# Altium schematic sheet 12V_Buck_Converter.SchDoc
size A3; SheetNumber: 1; SheetTotal: 2
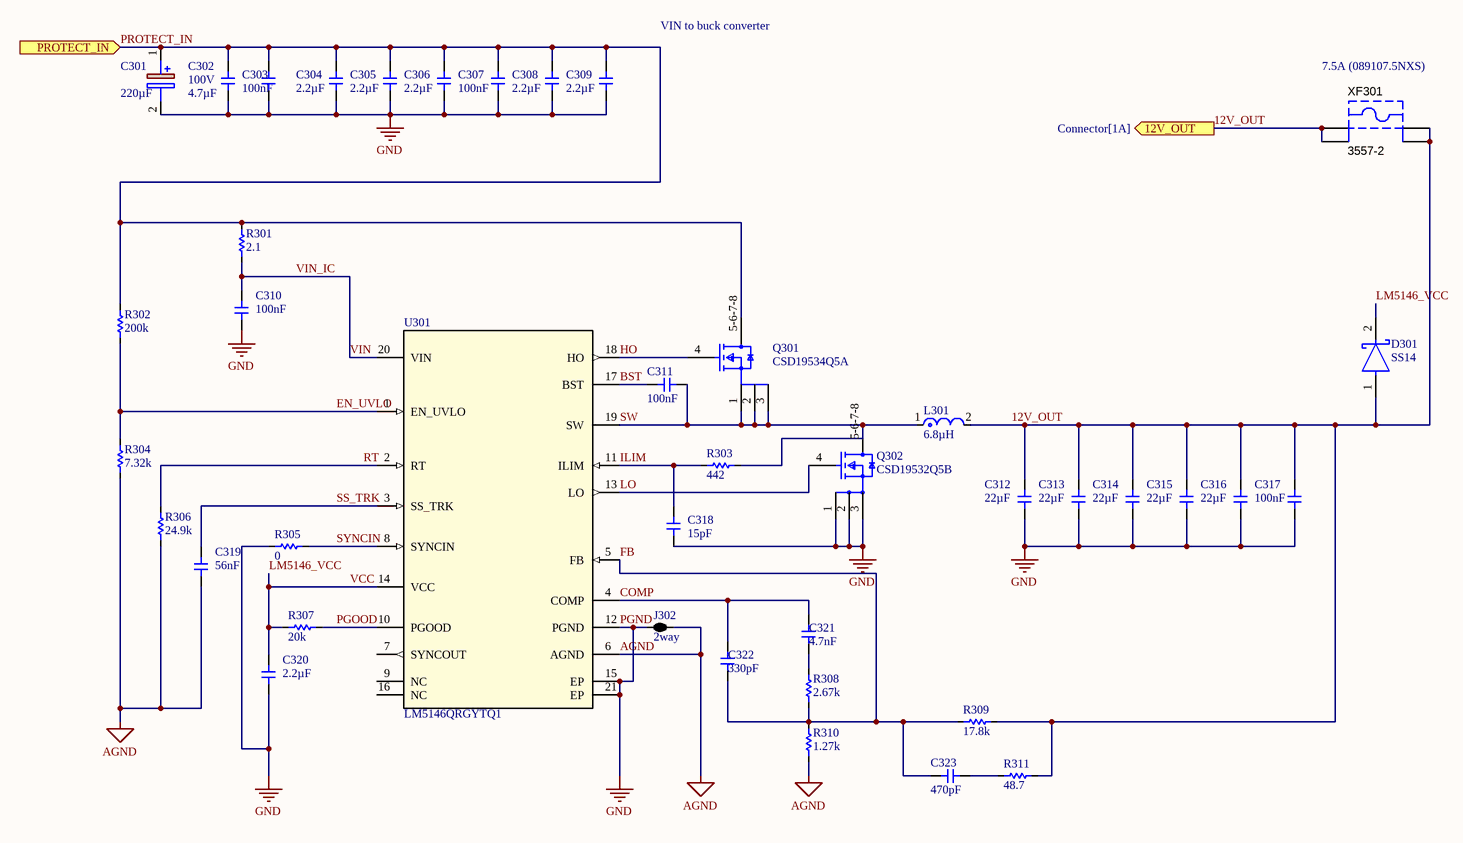
[diagram p0: 12V_Buck_Converter.SchDoc]

## Parts
C301  220µF  [EEEFK0J103SM]
C302  Voltage: 100V  Capacitance: 4.7µF  [1210]  (hidden comment: non-polar_Capacitor)
C303  Capacitance: 100nF  [0603]  (hidden comment: non-polar_Capacitor)
C304  Capacitance: 2.2µF  [1210]  (hidden comment: non-polar_Capacitor)
C305  Capacitance: 2.2µF  [1210]  (hidden comment: non-polar_Capacitor)
C306  Capacitance: 2.2µF  [0603]  (hidden comment: non-polar_Capacitor)
C307  Capacitance: 100nF  [0603]  (hidden comment: non-polar_Capacitor)
C308  Capacitance: 2.2µF  [1210]  (hidden comment: non-polar_Capacitor)
C309  Capacitance: 2.2µF  [1210]  (hidden comment: non-polar_Capacitor)
C310  Capacitance: 100nF  [0603]  (hidden comment: non-polar_Capacitor)
C311  Capacitance: 100nF  [0603]  (hidden comment: non-polar_Capacitor)
C312  Capacitance: 22µF  [1210]  (hidden comment: non-polar_Capacitor)
C313  Capacitance: 22µF  [1210]  (hidden comment: non-polar_Capacitor)
C314  Capacitance: 22µF  [1210]  (hidden comment: non-polar_Capacitor)
C315  Capacitance: 22µF  [1210]  (hidden comment: non-polar_Capacitor)
C316  Capacitance: 22µF  [1210]  (hidden comment: non-polar_Capacitor)
C317  Capacitance: 100nF  [0603]  (hidden comment: non-polar_Capacitor)
C318  Capacitance: 15pF  [0603]  (hidden comment: non-polar_Capacitor)
C319  Capacitance: 56nF  [0603]  (hidden comment: non-polar_Capacitor)
C320  Capacitance: 2.2µF  [1206]  (hidden comment: non-polar_Capacitor)
C321  Capacitance: 4.7nF  [0603]  (hidden comment: non-polar_Capacitor)
C322  Capacitance: 330pF  [0603]  (hidden comment: non-polar_Capacitor)
C323  Capacitance: 470pF  [0603]  (hidden comment: non-polar_Capacitor)
D301  SS14  [FP-403AE-MFG]
J302  2way  [2way_LP]  (net tie, no BOM)
L301  Inductance: 6.8µH  [FP-XAL1010-MFG]  (hidden comment: XAL1010)
Q301  CSD19534Q5A  [FP-DQJ0008A-MFG]
Q302  CSD19532Q5B  [FP-DNK0008A-MFG]
R301  Resistance: 2.1  [0603]  (hidden comment: Resistor)
R302  Resistance: 200k  [0603]  (hidden comment: Resistor)
R303  Resistance: 442  [0805]  (hidden comment: Resistor)
R304  Resistance: 7.32k  [0603]  (hidden comment: Resistor)
R305  Resistance: 0  [0603]  (hidden comment: Resistor)
R306  Resistance: 24.9k  [0603]  (hidden comment: Resistor)
R307  Resistance: 20k  [0603]  (hidden comment: Resistor)
R308  Resistance: 2.67k  [0603]  (hidden comment: Resistor)
R309  Resistance: 17.8k  [0603]  (hidden comment: Resistor)
R310  Resistance: 1.27k  [0603]  (hidden comment: Resistor)
R311  Resistance: 48.7  [0603]  (hidden comment: Resistor)
U301  LM5146QRGYTQ1  [RGY0020B]
XF301  3557-2  [KSTN-3557-2]

## Ports
12V_OUT (out, see Connector[1A]), PROTECT_IN (in)

## Nets
AGND: C319.1 J302.2 R304.1 R306.1 R310.2 U301.6(AGND)
PGND: C301.2(-) C302.1 C303.1 C304.1 C305.1 C306.1 C307.1 C308.1 C309.1 C310.1 C312.1 C313.1 C314.1 C315.1 C316.1 C317.1 C318.2 C320.1 J302.1 Q302.1(S) Q302.2(S) Q302.3(S) R305.1 U301.12(PGND) U301.15(EP) U301.21(EP)  [also labelled GND]
12V_OUT: C312.2 C313.2 C314.2 C315.2 C316.2 C317.2 D301.1(A) L301.2 R309.1 R311.1 XF301.1 XF301.2 XF301.3 XF301.4 ; port 12V_OUT
BST: C311.2 U301.17(BST)
COMP: C321.2 C322.2 U301.4(COMP)
EN_UVLO: R302.1 R304.2 U301.1(EN_UVLO)
FB: C322.1 C323.2 R308.1 R309.2 R310.1 U301.5(FB)
HO: Q301.4(G) U301.18(HO)
ILIM: C318.1 R303.1 U301.11(ILIM)
LM5146_VCC: C320.2 D301.2(C) R307.2 U301.14(VCC)  [also labelled VCC]
LO: Q302.4(G) U301.13(LO)
PGOOD: R307.1 U301.10(PGOOD)
PROTECT_IN: C301.1(+) C302.2 C303.2 C304.2 C305.2 C306.2 C307.2 C308.2 C309.2 Q301.5-6-7-8(D) R301.2 R302.2 ; port PROTECT_IN
RT: R306.2 U301.2(RT)
SS_TRK: C319.2 U301.3(SS_TRK)
SW: C311.1 L301.1 Q301.1(S) Q301.2(S) Q301.3(S) Q302.5-6-7-8(D) R303.2 U301.19(SW)
SYNCIN: R305.2 U301.8(SYNCIN)
VIN: C310.2 R301.1 U301.20(VIN)  [also labelled VIN_IC]
NetC321_1: C321.1 R308.2
NetC323_1: C323.1 R311.2

Not connected (* = marked no-connect by the designer): U301 7(SYNCOUT) 9(NC) 16(NC)

## Notes on the sheet
- VIN to buck converter
- 7.5A (089107.5NXS)

## Library data of the parts
C301 = EEV-FK2A221M: Capacitor Polarised; Manufacturer_Name: Panasonic; Datasheet Link: http://industrial.panasonic.com/cdbs/www-data/pdf/RDE0000/ABA0000C1181.pdf; Height: 17mm; Manufacturer_Part_Number: EEV-FK2A221M; Mouser Part Number: 667-EEV-FK2A221M; Mouser Price/Stock: https://www.mouser.co.uk/ProductDetail/Panasonic/EEV-FK2A221M?qs=f%252BPvLx1Hi0lum2kXFW5X7Q%3D%3D; Arrow Part Number: EEV-FK2A221M; Arrow Price/Stock: https://www.arrow.com/en/products/eevfk2a221m/panasonic?utm_currency=USD&region=nac
C302 = CMP-024-000020-16: SMD type ceramic capacitor; Source: robit_passive.SchLib; Design Item ID: Capacitor
C303 C317 = CMP-024-000020-16: SMD type ceramic capacitor; Voltage: 100V; Source: robit_passive.SchLib; Design Item ID: Capacitor
C304-C316 C318-C323 = CMP-024-000020-16: SMD type ceramic capacitor; Voltage: 50V; Source: robit_passive.SchLib; Design Item ID: Capacitor
D301 = CMP-2000-04943-2: DIODE SCHOTTKY 40V 1A SMA; Manufacturer: ON Semiconductor; Peak Reverse Current: 0.2mA; Max Junction Temp: +125°C; Standoff Height: 0.05mm; Max Surge Forward Current: 40A; Mouser Description: Schottky Diodes & Rectifiers SMA 40V 1.0A; RoHS: TRUE; Lead Free: Yes; Manufacturer Part Number: SS14; Device Class L3: Schottky Diodes; Category: Diode; Automotive: No; Digikey Description: DIODE SCHOTTKY 40V 1A SMA; ComponentLink2Description: Datasheet; Device Class L2: Diodes; Height: 2.5mm; Temperature Range High: +125°C; ComponentLink2URL: https://www.onsemi.com/pub/Collateral/SS19-D.PDF; Device Class L1: Discrete Semiconductors; Package: 403AE; Octopart: https://octopart.com/ss14-on+semiconductor-29205033; Max Repetitive Reverse Voltage: 40V; Temperature Range Low: -65°C; Forward Current: 1A; Temperature: -65°C to +125°C
J302 = CMP-187-000000-1: 2 way net tie junction; Source: NetTie.SchLib; ComponentLink1Description: Source; Design Item ID: 2way; Component Type: Net Tie; ComponentLink1URL: http://www.edatools.cz/addons; Pin Count: 2; FootprintNote: LP=12mil, MP=40mil, HP=120mil
L301 = CMP-028-000007-1: General Purpose Inductor, 5.6uH, 20%, 1 Element, Composite-Core, SMD, 4539
Q301 = CMP-04962-000018-1: MOSFET N-CH 100V 50 8SON; Manufacturer: Texas Instruments; Reverse Recovery Time: 53ns; Turn Off Delay Time: 20ns; Gate To Source Voltage: 20V; Turn On Delay Time: 9ns; Depletion Mode: False; Threshold Vgs Max: 3.4V; Pulse Drain Current: 137A; Number Of N Channels: 1; Input Capacitace At Vds: 1290pF @ 50V; Max Junction Temp: +150°C; Power Dissipation: 3.2W; Max Forward Diode Voltage: 1V; Continuous Drain Current: 10A; Drain To Source Resistance: 12.6mΩ; Threshold Vgs Min: 2.4V; Transconductance: 47S; Gate Charge At Vgs: 17nC @ 10V; Reverse Recovery Charge: 134nC; Typ Forward Diode Voltage: 0.8V; Rthja Max: 50°C/W; Drain To Source Breakdown Voltage: 100V; Device Class L2: Transistors; Height: 1.1mm; Temperature Range Low: -55°C; Temperature Range High: +150°C; Temperature: -55°C to +150°C; Device Class L1: Discrete Semiconductors; ComponentLink2Description: Datasheet; Number Of Channels: 1; Lead Free: Yes; Octopart: https://octopart.com/csd19534q5a-texas+instruments-46749514; Package: DQJ0008A; Category: Trans; Mouser Description: MOSFET N-Channel MOSFET; Device Class L3: MOSFETs; Digikey Description: MOSFET N-CH 100V 50 8SON; Drain To Source Voltage: 100V; Automotive: No; ComponentLink2URL: http://www.ti.com/lit/ds/symlink/csd19534q5a.pdf; RoHS: TRUE; Manufacturer Part Number: CSD19534Q5A
Q302 = CMP-00003-1: 100-V, N channel NexFET™ power MOSFET, single SON 5 mm x 6 mm, 4.9 mOhm 8-VSON-CLIP -55 to 150; Manufacturer Lifecycle Status: ACTIVE; Gate to Source Voltage (Vgs): 20V; Number of Elements: 1; Threshold Voltage: 2.6V; Max Power Dissipation: 3.1W; Rds On Max: 4.9mΩ; Drain to Source Voltage (Vdss): 100V; Max Junction Temperature (Tj): 150°C; Drain to Source Resistance: 4.6mΩ; Fall Time: 6ns; Turn-On Delay Time: 7ns; Turn-Off Delay Time: 22ns; Input Capacitance: 4.81nF; Continuous Drain Current (ID): 100A; Contact Plating: Tin; Power Dissipation: 3.1W; Thickness: 950µm; Min Operating Temperature: -55°C; Schedule B: 8541290080, 8541290080; Lead Free: Contains Lead; Drain to Source Breakdown Voltage: 100V; REACH SVHC: No; Max Operating Temperature: 150°C; Height: 0m; Number of Channels: 1; Packaging: Digi-Reel®; Rise Time: 6ns; Length: 5mm; Width: 5mm; RoHS: Compliant; Pins: 8; Lifecycle Status: Production; Element Configuration: Single; Mounting Technology: Surface Mount
R301-R311 = CMP-029-000004-8: SMD type resistor; Design Item ID: Resistor; Source: robit_passive.SchLib
U301 = LM5146QRGYTQ1: Automotive 100-V synchronous buck DC/DC controller with wide duty-cycle range 20-VQFN -40 to 150; Manufacturer_Name: Texas Instruments; TYPE: TYPE; RefDes: RefDes; Copyright: Copyright (C) 2026 Ultra Librarian. All rights reserved.; Manufacturer_Part_Number: LM5146QRGYTQ1
XF301 = CMP-2000-05461-1: FUSE HOLDER, PCB MOUNT, 500VAC, 20A, ROHS; Manufacturer: Keystone-Electronics; Number of Circuits: 1; Voltage: 500V; Fuseholder Type: Block; Fuse Type: Blade; Fuse Size: 0.43"Lx0.15"Wx0.64"H(10.92mmx3.81mmx16.25mm); For Use With/Related Products: ATC,ATO257,MINI897; Current Rating: 30A; Datasheet URL: http://datasheet.octopart.com/3557-2-Keystone-datasheet-15715937.pdf; Orientation: Vertical; Family: Fuseholders; Datasheet Version: Apr-13; Contact Finish: TinNickel; Mounting Type: PCB; Series: -; Category: CircuitProtection; Termination Style: PCPin; Contact Material: Brass; Manufacturer URL: http://www.keyelco.com/